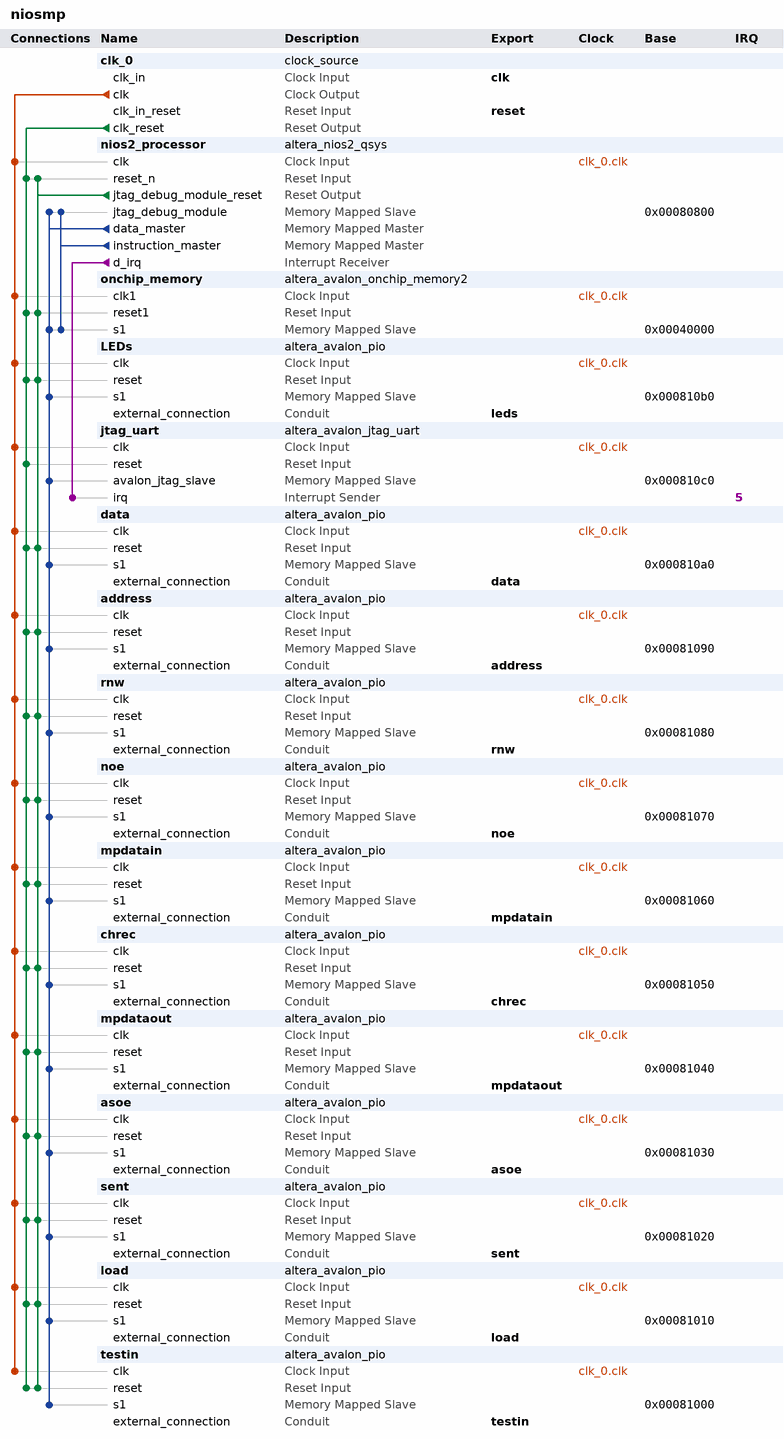
[diagram p0: system contents]
# Platform Designer (Qsys) system niosmp, Cyclone V 5CSEMA5F31C6
# Parameters at their usual value, and those the tool derives, are not listed.
package require -exact qsys 14.0
create_system niosmp
set_project_property DEVICE_FAMILY {Cyclone V}
set_project_property DEVICE 5CSEMA5F31C6

add_instance clk_0 clock_source 14.0
set_instance_parameter_value clk_0 clockFrequency 50000000

add_instance nios2_processor altera_nios2_qsys 14.0
set_instance_parameter_value nios2_processor resetrequest_enabled true
set_instance_parameter_value nios2_processor resetSlave onchip_memory.s1
set_instance_parameter_value nios2_processor mmu_TLBMissExcSlave None
set_instance_parameter_value nios2_processor exceptionSlave onchip_memory.s1
set_instance_parameter_value nios2_processor breakSlave nios2_processor.jtag_debug_module
set_instance_parameter_value nios2_processor impl Fast
set_instance_parameter_value nios2_processor icache_size 4096

add_instance onchip_memory altera_avalon_onchip_memory2 14.0
set_instance_parameter_value onchip_memory dataWidth 32
set_instance_parameter_value onchip_memory dualPort false
set_instance_parameter_value onchip_memory initMemContent true
set_instance_parameter_value onchip_memory initializationFileName onchip_mem.hex
set_instance_parameter_value onchip_memory memorySize 204800

add_instance LEDs altera_avalon_pio 14.0
set_instance_parameter_value LEDs direction Output
set_instance_parameter_value LEDs width 8

add_instance jtag_uart altera_avalon_jtag_uart 14.0
set_instance_parameter_value jtag_uart simInteractiveOptions NO_INTERACTIVE_WINDOWS

add_instance data altera_avalon_pio 14.0
set_instance_parameter_value data direction Bidir
set_instance_parameter_value data width 8

add_instance address altera_avalon_pio 14.0
set_instance_parameter_value address direction Output
set_instance_parameter_value address width 8

add_instance rnw altera_avalon_pio 14.0
set_instance_parameter_value rnw direction Output
set_instance_parameter_value rnw width 1

add_instance noe altera_avalon_pio 14.0
set_instance_parameter_value noe direction Output
set_instance_parameter_value noe width 1

add_instance mpdatain altera_avalon_pio 14.0
set_instance_parameter_value mpdatain direction Input
set_instance_parameter_value mpdatain width 8

add_instance chrec altera_avalon_pio 14.0
set_instance_parameter_value chrec direction Input
set_instance_parameter_value chrec width 1

add_instance mpdataout altera_avalon_pio 14.0
set_instance_parameter_value mpdataout direction Output
set_instance_parameter_value mpdataout width 8

add_instance asoe altera_avalon_pio 14.0
set_instance_parameter_value asoe direction Output
set_instance_parameter_value asoe width 1

add_instance sent altera_avalon_pio 14.0
set_instance_parameter_value sent direction Input
set_instance_parameter_value sent width 1

add_instance load altera_avalon_pio 14.0
set_instance_parameter_value load direction Output
set_instance_parameter_value load width 1

add_instance testin altera_avalon_pio 14.0
set_instance_parameter_value testin direction Input
set_instance_parameter_value testin width 1

# connections
add_connection clk_0.clk address.clk clock
add_connection clk_0.clk asoe.clk clock
add_connection clk_0.clk chrec.clk clock
add_connection clk_0.clk data.clk clock
add_connection clk_0.clk jtag_uart.clk clock
add_connection clk_0.clk LEDs.clk clock
add_connection clk_0.clk load.clk clock
add_connection clk_0.clk mpdatain.clk clock
add_connection clk_0.clk mpdataout.clk clock
add_connection clk_0.clk nios2_processor.clk clock
add_connection clk_0.clk noe.clk clock
add_connection clk_0.clk onchip_memory.clk1 clock
add_connection clk_0.clk rnw.clk clock
add_connection clk_0.clk sent.clk clock
add_connection clk_0.clk testin.clk clock
add_connection clk_0.clk_reset address.reset reset
add_connection clk_0.clk_reset asoe.reset reset
add_connection clk_0.clk_reset chrec.reset reset
add_connection clk_0.clk_reset data.reset reset
add_connection clk_0.clk_reset jtag_uart.reset reset
add_connection clk_0.clk_reset LEDs.reset reset
add_connection clk_0.clk_reset load.reset reset
add_connection clk_0.clk_reset mpdatain.reset reset
add_connection clk_0.clk_reset mpdataout.reset reset
add_connection clk_0.clk_reset nios2_processor.reset_n reset
add_connection clk_0.clk_reset noe.reset reset
add_connection clk_0.clk_reset onchip_memory.reset1 reset
add_connection clk_0.clk_reset rnw.reset reset
add_connection clk_0.clk_reset sent.reset reset
add_connection clk_0.clk_reset testin.reset reset
add_connection nios2_processor.jtag_debug_module_reset address.reset reset
add_connection nios2_processor.jtag_debug_module_reset asoe.reset reset
add_connection nios2_processor.jtag_debug_module_reset chrec.reset reset
add_connection nios2_processor.jtag_debug_module_reset data.reset reset
add_connection nios2_processor.jtag_debug_module_reset LEDs.reset reset
add_connection nios2_processor.jtag_debug_module_reset load.reset reset
add_connection nios2_processor.jtag_debug_module_reset mpdatain.reset reset
add_connection nios2_processor.jtag_debug_module_reset mpdataout.reset reset
add_connection nios2_processor.jtag_debug_module_reset nios2_processor.reset_n reset
add_connection nios2_processor.jtag_debug_module_reset noe.reset reset
add_connection nios2_processor.jtag_debug_module_reset onchip_memory.reset1 reset
add_connection nios2_processor.jtag_debug_module_reset rnw.reset reset
add_connection nios2_processor.jtag_debug_module_reset sent.reset reset
add_connection nios2_processor.jtag_debug_module_reset testin.reset reset
add_connection nios2_processor.data_master address.s1 avalon
set_connection_parameter_value nios2_processor.data_master/address.s1 baseAddress 0x00081090
add_connection nios2_processor.data_master asoe.s1 avalon
set_connection_parameter_value nios2_processor.data_master/asoe.s1 baseAddress 0x00081030
add_connection nios2_processor.data_master chrec.s1 avalon
set_connection_parameter_value nios2_processor.data_master/chrec.s1 baseAddress 0x00081050
add_connection nios2_processor.data_master data.s1 avalon
set_connection_parameter_value nios2_processor.data_master/data.s1 baseAddress 0x000810a0
add_connection nios2_processor.data_master jtag_uart.avalon_jtag_slave avalon
set_connection_parameter_value nios2_processor.data_master/jtag_uart.avalon_jtag_slave baseAddress 0x000810c0
add_connection nios2_processor.data_master LEDs.s1 avalon
set_connection_parameter_value nios2_processor.data_master/LEDs.s1 baseAddress 0x000810b0
add_connection nios2_processor.data_master load.s1 avalon
set_connection_parameter_value nios2_processor.data_master/load.s1 baseAddress 0x00081010
add_connection nios2_processor.data_master mpdatain.s1 avalon
set_connection_parameter_value nios2_processor.data_master/mpdatain.s1 baseAddress 0x00081060
add_connection nios2_processor.data_master mpdataout.s1 avalon
set_connection_parameter_value nios2_processor.data_master/mpdataout.s1 baseAddress 0x00081040
add_connection nios2_processor.data_master nios2_processor.jtag_debug_module avalon
set_connection_parameter_value nios2_processor.data_master/nios2_processor.jtag_debug_module baseAddress 0x00080800
add_connection nios2_processor.data_master noe.s1 avalon
set_connection_parameter_value nios2_processor.data_master/noe.s1 baseAddress 0x00081070
add_connection nios2_processor.data_master onchip_memory.s1 avalon
set_connection_parameter_value nios2_processor.data_master/onchip_memory.s1 baseAddress 0x00040000
add_connection nios2_processor.data_master rnw.s1 avalon
set_connection_parameter_value nios2_processor.data_master/rnw.s1 baseAddress 0x00081080
add_connection nios2_processor.data_master sent.s1 avalon
set_connection_parameter_value nios2_processor.data_master/sent.s1 baseAddress 0x00081020
add_connection nios2_processor.data_master testin.s1 avalon
set_connection_parameter_value nios2_processor.data_master/testin.s1 baseAddress 0x00081000
add_connection nios2_processor.instruction_master nios2_processor.jtag_debug_module avalon
set_connection_parameter_value nios2_processor.instruction_master/nios2_processor.jtag_debug_module baseAddress 0x00080800
add_connection nios2_processor.instruction_master onchip_memory.s1 avalon
set_connection_parameter_value nios2_processor.instruction_master/onchip_memory.s1 baseAddress 0x00040000
add_connection nios2_processor.d_irq jtag_uart.irq interrupt
set_connection_parameter_value nios2_processor.d_irq/jtag_uart.irq irqNumber 5

# exported interfaces
add_interface clk clock sink
set_interface_property clk EXPORT_OF clk_0.clk_in
add_interface reset reset sink
set_interface_property reset EXPORT_OF clk_0.clk_in_reset
add_interface leds conduit end
set_interface_property leds EXPORT_OF LEDs.external_connection
add_interface data conduit end
set_interface_property data EXPORT_OF data.external_connection
add_interface address conduit end
set_interface_property address EXPORT_OF address.external_connection
add_interface rnw conduit end
set_interface_property rnw EXPORT_OF rnw.external_connection
add_interface noe conduit end
set_interface_property noe EXPORT_OF noe.external_connection
add_interface mpdatain conduit end
set_interface_property mpdatain EXPORT_OF mpdatain.external_connection
add_interface chrec conduit end
set_interface_property chrec EXPORT_OF chrec.external_connection
add_interface mpdataout conduit end
set_interface_property mpdataout EXPORT_OF mpdataout.external_connection
add_interface asoe conduit end
set_interface_property asoe EXPORT_OF asoe.external_connection
add_interface sent conduit end
set_interface_property sent EXPORT_OF sent.external_connection
add_interface load conduit end
set_interface_property load EXPORT_OF load.external_connection
add_interface testin conduit end
set_interface_property testin EXPORT_OF testin.external_connection

set_interconnect_requirement {$system} qsys_mm.clockCrossingAdapter HANDSHAKE
set_interconnect_requirement {$system} qsys_mm.maxAdditionalLatency 1
set_interconnect_requirement {$system} qsys_mm.insertDefaultSlave FALSE

save_system niosmp.qsys
